# EAGLE design ethero_v1 (EAGLE 6.4)
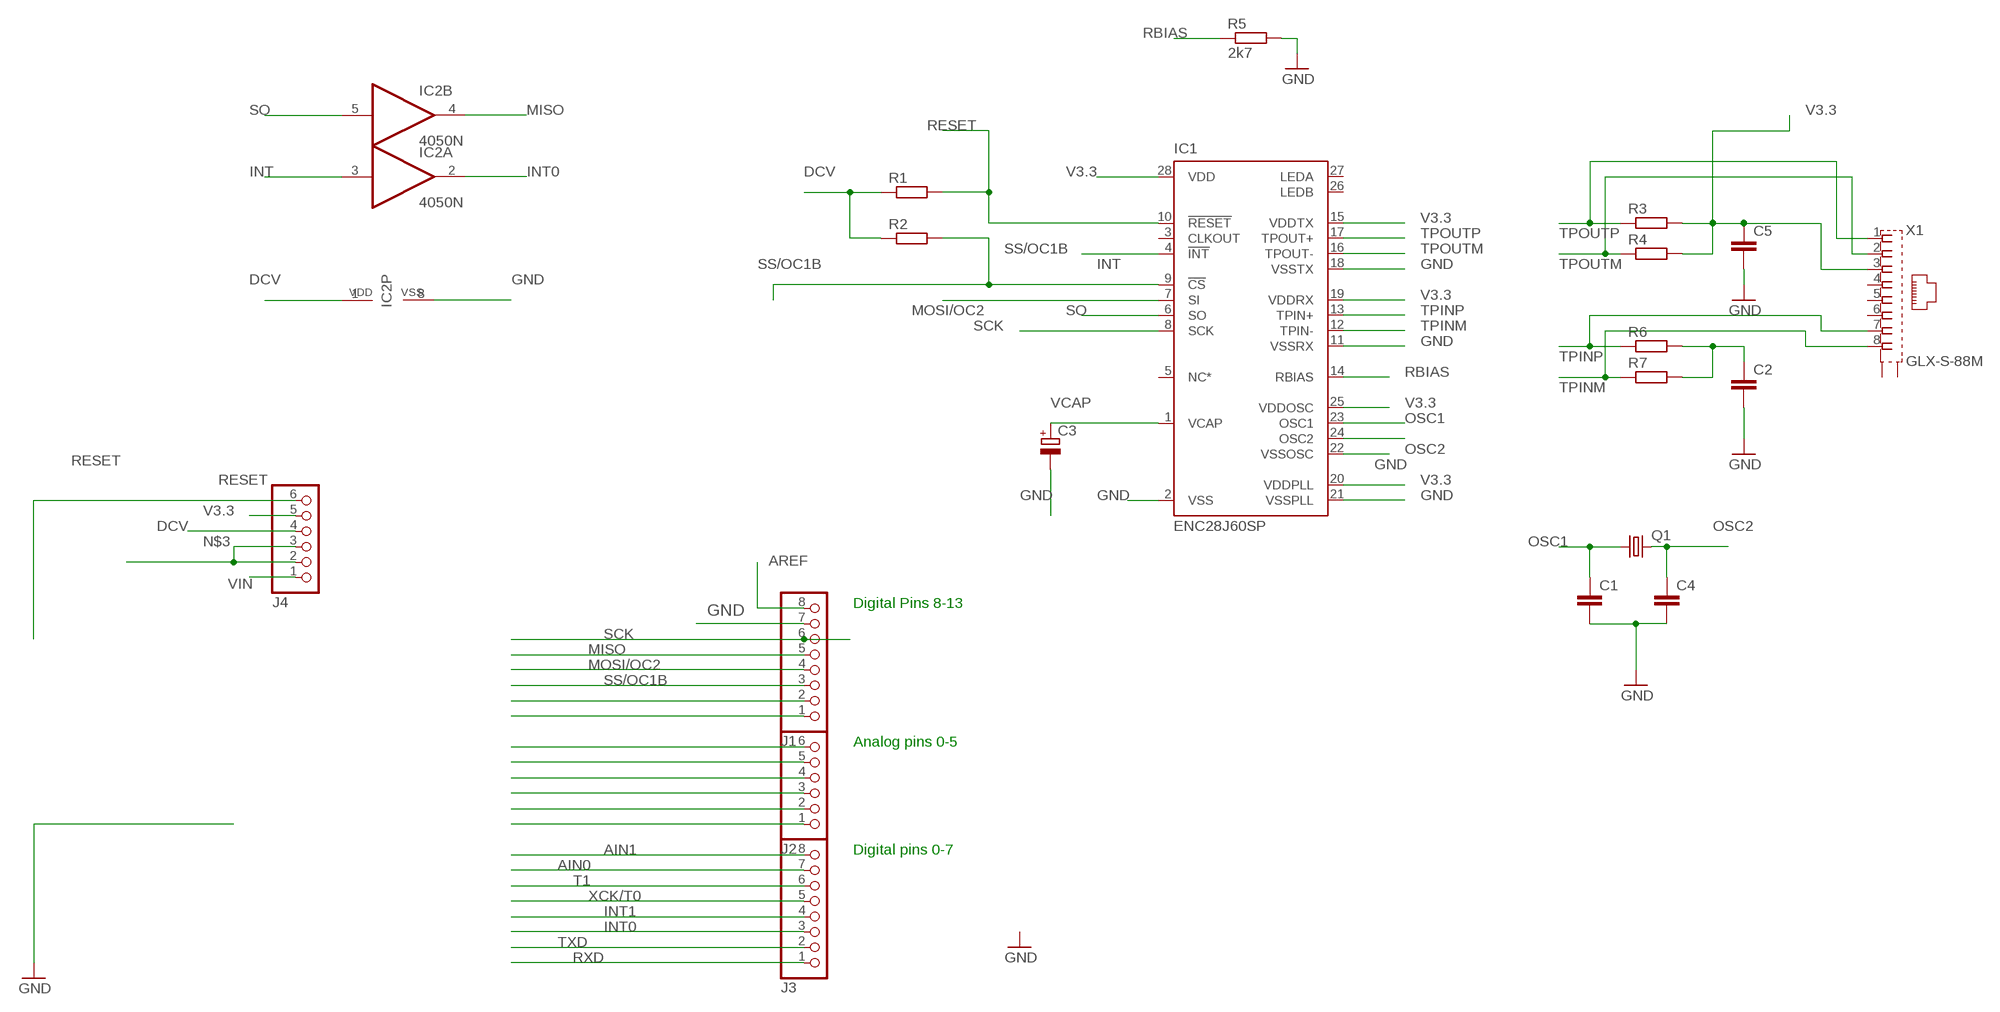
[diagram p0: schematic, sheet 1]

## Parts
C1  C-EU025-025X050  [C025-025X050]
C2  C-EU025-025X050  [C025-025X050]
C3  CPOL-EUE5-5  [E5-5]
C4  C-EU025-025X050  [C025-025X050]
C5  C-EU025-025X050  [C025-025X050]
IC1  ENC28J60SP  [DIL28-3]
IC2  4050N  [DIL16]
J1  PINHD-1X8  [1X08]
J2  PINHD-1X6  [1X06]
J3  PINHD-1X8  [1X08]
J4  PINHD-1X6  [1X06]
Q1  CRYSTALHC18U-V  [HC18U-V]
R1  R-EU_0204/7  [0204/7]
R2  R-EU_0204/7  [0204/7]
R3  R-EU_0204/7  [0204/7]
R4  R-EU_0204/7  [0204/7]
R5  2k7  R-EU_0204/7  [0204/7]
R6  R-EU_0204/7  [0204/7]
R7  R-EU_0204/7  [0204/7]
X1  GLX-S-88M  [GLX-S-88M]

## Nets
AIN0: J3.7
AIN1: J3.8
AREF: J1.8
DCV [power]: IC2.1(P:VDD) J4.4 R1.1 R2.1
GND [power]: C1.2 C2.2 C3.- C4.2 C5.2 IC1.2(VSS) IC1.11(VSSRX) IC1.18(VSSTX) IC1.21(VSSPLL) IC1.22(VSSOSC) IC2.8(P:VSS) J1.7 R5.2
INT: IC1.4(!INT) IC2.3(A:I)
INT0: IC2.2(A:O) J3.3
INT1: J3.4
MISO: IC2.4(B:O) J1.5
MOSI/OC2: IC1.7(SI) J1.4
N$2: J1.2
N$3 [power]: J4.2 J4.3
N$5: C2.1 R6.2 R7.2
N$16: J2.1
N$17: J2.2
N$18: J2.3
N$19: J2.4
N$20: J2.5
N$21: J2.6
N$28: J1.1
OSC1: C1.1 IC1.23(OSC1) Q1.1
OSC2: C4.1 IC1.24(OSC2) Q1.2
RBIAS: IC1.14(RBIAS) R5.1
RESET: IC1.10(!RESET) J4.6 R1.2
RXD: J3.1
SCK: IC1.8(SCK) J1.6
SO: IC1.6(SO) IC2.5(B:I)
SS/OC1B: IC1.9(!CS) J1.3 R2.2
T1: J3.6
TPINM: IC1.12(TPIN-) R7.1 X1.8
TPINP: IC1.13(TPIN+) R6.1 X1.7
TPOUTM: IC1.16(TPOUT-) R4.1 X1.2
TPOUTP: IC1.17(TPOUT+) R3.1 X1.1
TXD: J3.2
V3.3: C5.1 IC1.15(VDDTX) IC1.19(VDDRX) IC1.20(VDDPLL) IC1.25(VDDOSC) IC1.28(VDD) J4.5 R3.2 R4.2 X1.3
VCAP: C3.+ IC1.1(VCAP)
VIN [power]: J4.1
XCK/T0: J3.5
Unconnected: IC1.3(CLKOUT) IC1.5(NC*) IC1.26(LEDB) IC1.27(LEDA) IC2.6(C:O) IC2.7(C:I) IC2.9(D:I) IC2.10(D:O) IC2.11(E:I) IC2.12(E:O) IC2.14(F:I) IC2.15(F:O) X1.4 X1.5 X1.6 X1.S1 X1.S2

## Notes on the sheet
- Digital Pins 8-13
- Analog pins 0-5
- Digital pins 0-7

## Library data of the parts
C1 C2 C4 C5 = resistor:C-EU: CAPACITOR, European symbol
C3 = rcl:CPOL-EU: POLARIZED CAPACITOR, European symbol
IC1 = microchip:ENC28J60: Stand-Alone Ethernet Controller with SPI Interface Source: http://ww1.microchip.com/downloads/en/DeviceDoc/39662c.pdf; MF: MICROCHIP; MPN: ENC28J60/SP; OC_FARNELL: 1084619; OC_NEWARK: 96K3661
IC2 = 40xx:4050: Hex non-inverting BUFFER
J1 J3 = pinhead:PINHD-1X8: PIN HEADER
J2 J4 = pinhead:PINHD-1X6: PIN HEADER
Q1 = crystal:CRYSTAL: CRYSTAL; OC_FARNELL: unknown; OC_NEWARK: unknown
R1-R7 = resistor:R-EU_: RESISTOR, European symbol
X1 = con-kycon:GLX-S-88M: Mod. Jack, Right Angle, 8 posiotion, 8 contatcs RJ45 Source: GLX-S-88M.pdf; OC_FARNELL: unknown; OC_NEWARK: unknown

## Net classes
0 default: width 0.203 mm, clearance 0.203 mm
1 power: width 0.6 mm, clearance 0.305 mm
2 finepitch: width 0.203 mm, clearance 0.203 mm

## Board
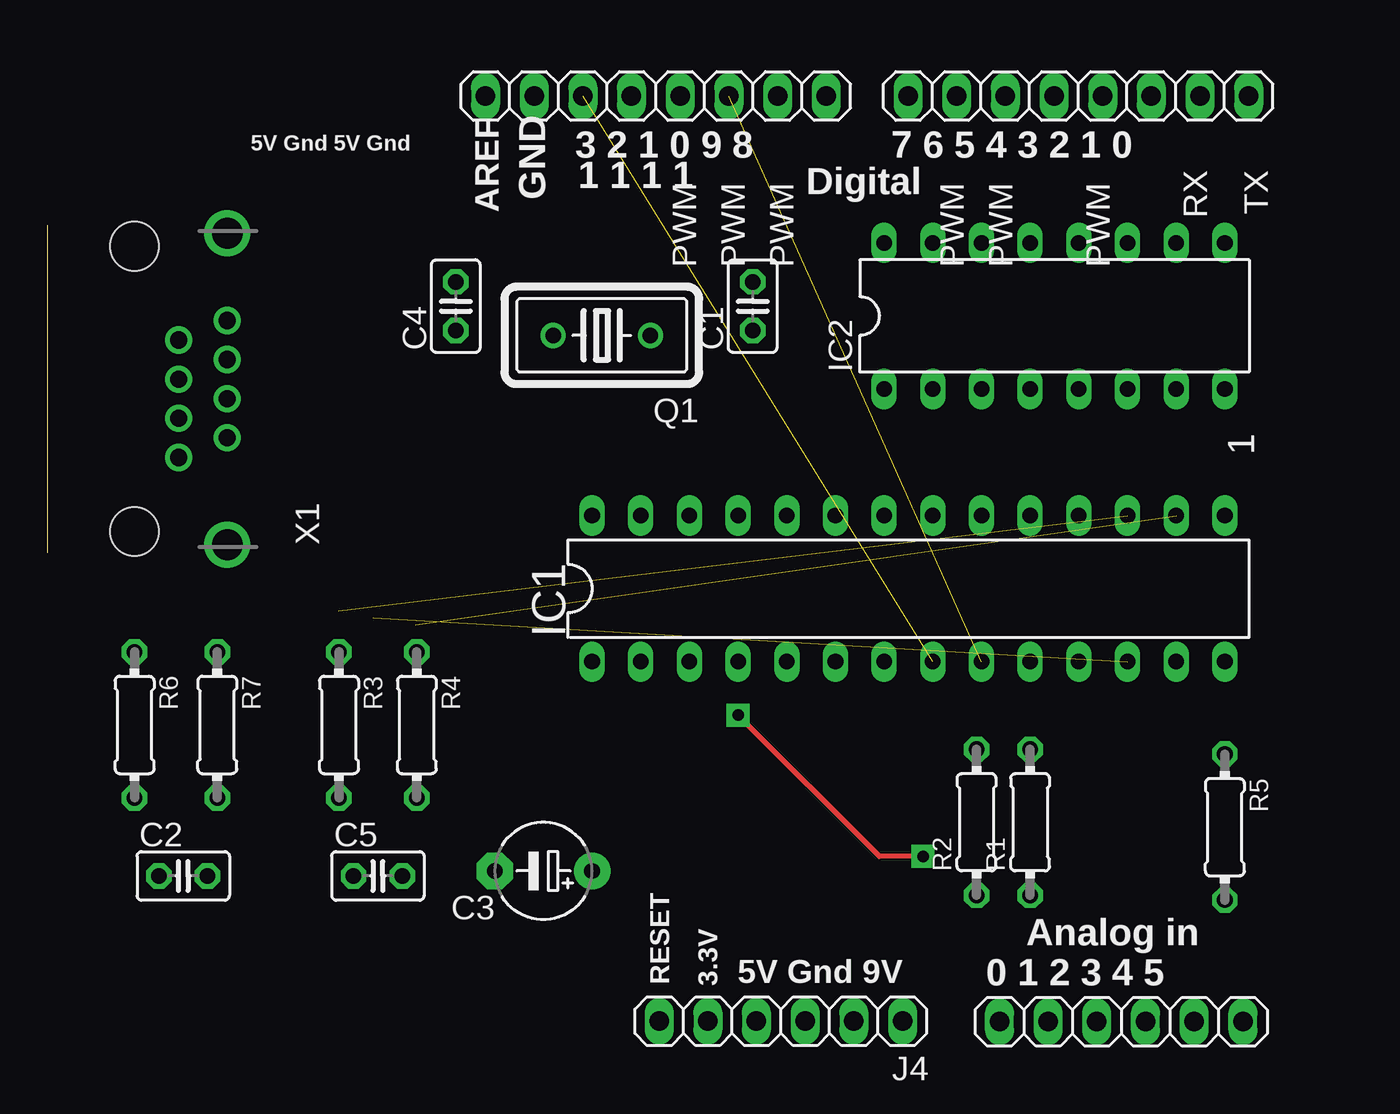
[diagram p1: board, top side]
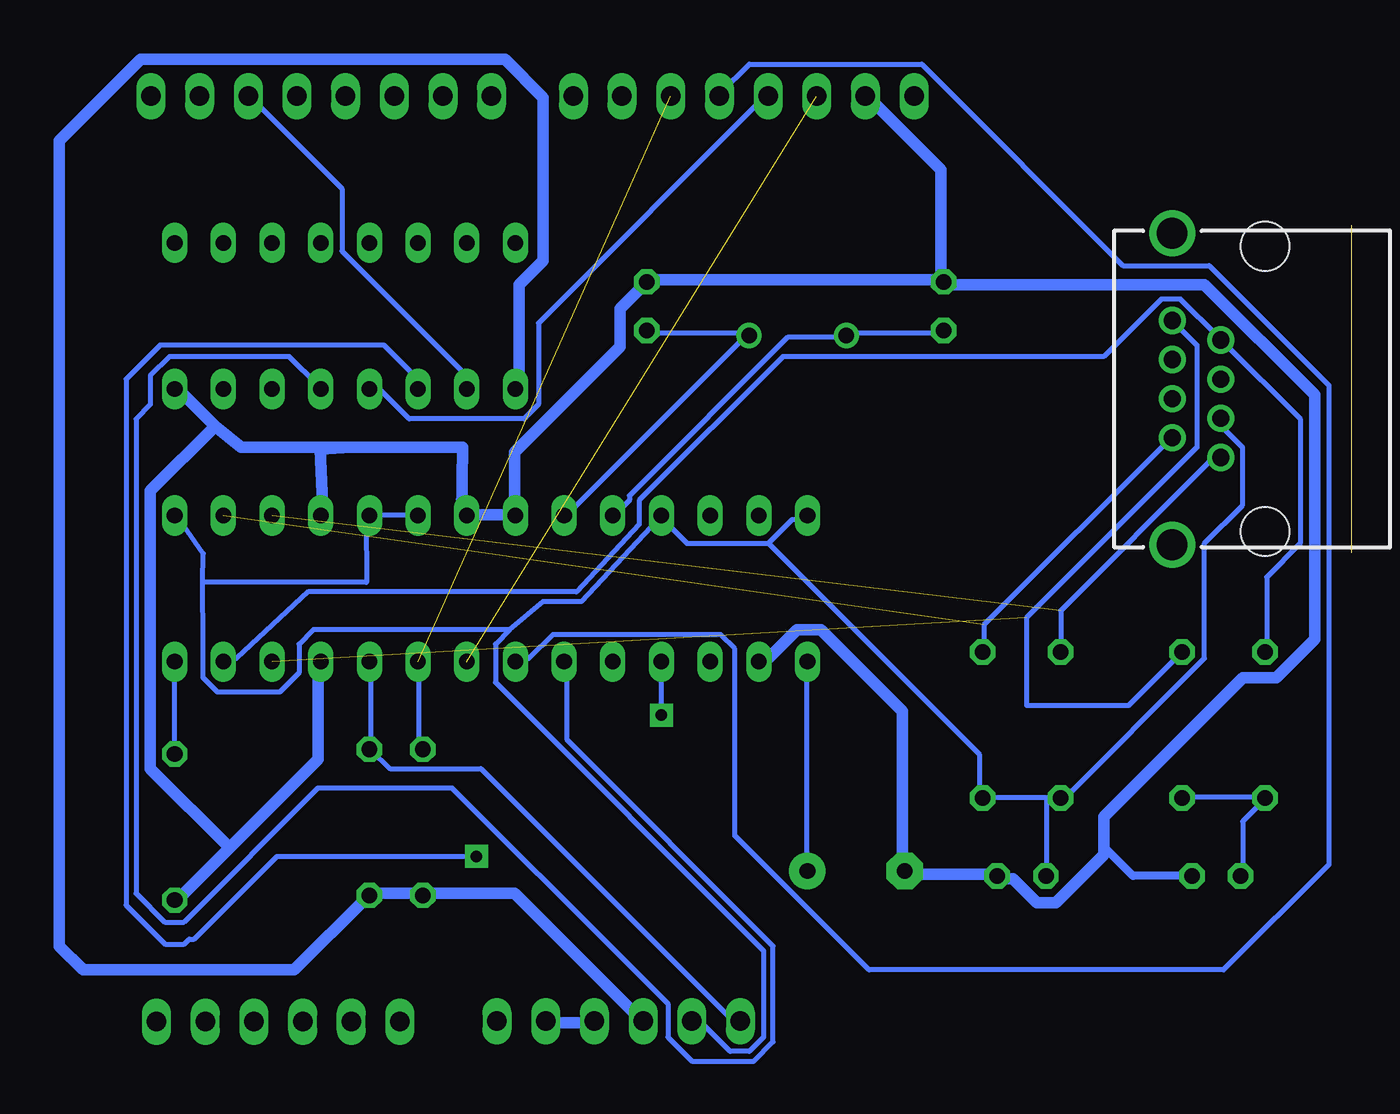
[diagram p2: board, bottom side, seen from below]

Size 0 x 17.06 mm. Coordinates in mm from the lower left corner, seen from the top.
Copper layers (1*16): Top 0.035mm / dielectric 1.5mm / Bottom 0.035mm
Design rules "default": minimum track width 10mil, minimum drill 0.6mm, track to track 8mil, track to pad 8mil, pad to pad 8mil, via to via 12mil, smd to smd 8mil, copper to edge 10mil, drill to drill 15mil, minimum pad ring 10mil, minimum via ring 12mil, stop-mask expansion 4mil, vias tented up to drill 0mil, thermal gap 10mil
tRestrict: area 12.4,21.9 to 16.1,25.6; area 63.1,6.5 to 66.9,10.3; area 63.1,-21.3 to 66.9,-17.5; 10 lines
bRestrict: area 12.4,21.9 to 16.1,25.6; area 63.1,6.5 to 66.9,10.3; area 63.1,-21.3 to 66.9,-17.5; 8 lines

### Footprints (pad centres in the part's own frame; a part is rotated, then mirrored left to right if it is on the bottom)
C025-025X050 = drill 0.813 octagon: 1 -1.27,0; 2 1.27,0
E5-5 = drill 0.813 pad 1.905: + -2.54,0 | drill 0.813 pad 1.905 octagon: - 2.54,0
DIL28-3 = drill 0.813 long: 1 -16.51,-3.81; 2 -13.97,-3.81; 3 -11.43,-3.81; 4 -8.89,-3.81; 5 -6.35,-3.81; 6 -3.81,-3.81; 7 -1.27,-3.81; 8 1.27,-3.81; 9 3.81,-3.81; 10 6.35,-3.81; 11 8.89,-3.81; 12 11.43,-3.81; 13 13.97,-3.81; 14 16.51,-3.81; 15 16.51,3.81; 16 13.97,3.81; 17 11.43,3.81; 18 8.89,3.81; 19 6.35,3.81; 20 3.81,3.81; 21 1.27,3.81; 22 -1.27,3.81; 23 -3.81,3.81; 24 -6.35,3.81; 25 -8.89,3.81; 26 -11.43,3.81; 27 -13.97,3.81; 28 -16.51,3.81
DIL16 = drill 0.813 long: 1 -8.89,-3.81; 2 -6.35,-3.81; 3 -3.81,-3.81; 4 -1.27,-3.81; 5 1.27,-3.81; 6 3.81,-3.81; 7 6.35,-3.81; 8 8.89,-3.81; 9 8.89,3.81; 10 6.35,3.81; 11 3.81,3.81; 12 1.27,3.81; 13 -1.27,3.81; 14 -3.81,3.81; 15 -6.35,3.81; 16 -8.89,3.81
1X08 = drill 1.016 long: 1 -8.89,0; 2 -6.35,0; 3 -3.81,0; 4 -1.27,0; 5 1.27,0; 6 3.81,0; 7 6.35,0; 8 8.89,0
1X06 = drill 1.016 long: 1 -6.35,0; 2 -3.81,0; 3 -1.27,0; 4 1.27,0; 5 3.81,0; 6 6.35,0
HC18U-V = drill 0.813: 1 -2.54,0; 2 2.54,0
0204/7 = drill 0.813 octagon: 1 -3.81,0; 2 3.81,0
GLX-S-88M = drill 0.9 pad 1.422: 1 -3.57,-2.3; 2 -2.55,-4.84; 3 -1.53,-2.3; 4 -0.51,-4.84; 5 0.51,-2.3; 6 1.53,-4.84; 7 2.55,-2.3; 8 3.57,-4.84 | drill 1.6 pad 2.184: S1 -8.125,-4.84; S2 8.125,-4.84 | hole 2.55: -7.44,0; 7.44,0

### Placement (x,y rotation side)
C1  36.78,12.85 90 top  (outside the outline)
C2  7.06,-16.87 0 top  (outside the outline)
C3  25.86,-16.61 180 top  (outside the outline)
C4  21.28,12.85 90 top  (outside the outline)
C5  17.22,-16.87 0 top  (outside the outline)
IC1  44.91,-1.88 0 top  (outside the outline)
IC2  52.53,12.34 0 top  (outside the outline)
J1  31.72,23.81 180 top  (outside the outline)
J2  56.01,-24.48 0 top  (outside the outline)
J3  53.77,23.81 180 top  (outside the outline)
J4  38.25,-24.45 180 top  (outside the outline)
Q1  28.9,11.33 180 top  (outside the outline)
R1  51.26,-14.07 90 top  (outside the outline)
R2  48.46,-14.07 90 top  (outside the outline)
R3  15.19,-8.99 270 top  (outside the outline)
R4  19.25,-8.99 270 top  (outside the outline)
R5  61.42,-14.33 270 top  (outside the outline)
R6  4.52,-8.99 270 top  (outside the outline)
R7  8.84,-8.99 270 top  (outside the outline)
X1  4.52,8.53 90 top  (outside the outline)

### Tracks (layer width: path | path; a pad name or v marks a point on that pad's centre or on a via)
DCV
  Bottom 0.6: IC2.1 43.43,8.72 43.43,13.97 42.18,15.22 42.18,23.72 44.18,25.72 63.18,25.72 67.43,21.47 67.43,-20.53 66.18,-21.78 55.18,-21.78 51.43,-18.03 R1.1 51.18,-17.78 48.68,-17.78 R2.1 48.18,-17.78 43.68,-17.78 37.18,-24.28 J4.4
GND
  Bottom 0.406: C2.2 11.41,-16.87 12.93,-15.34
  Bottom 0.6: 58.56,-15.4 61.18,-18.03 R5.2 | 58.56,-15.4 53.93,-10.78 53.93,-5.78 IC1.11 | 52.19,5.5 53.84,5.37 | 53.84,5.37 53.68,1.97 IC1.18 | 52.18,5.5 46.4,5.5 46.43,1.97 IC1.21 45.93,1.97 43.68,1.97 IC1.22 43.68,2.22 43.68,5.22 38.18,10.72 38.18,12.72 36.93,13.97 C1.2 36.68,14.22 21.68,14.22 C4.2 | 52.18,5.5 52.19,5.5 | 59.31,6.6 57.96,5.5 52.19,5.5 | 59.31,6.6 61.18,8.47 IC2.8 | 52.18,5.5 53.84,5.37 | 58.56,-15.4 62.68,-11.28 62.68,3.22 59.31,6.6 | IC1.2 30.93,-5.53 30.43,-5.53 28.93,-4.03 27.68,-4.03 23.43,-8.28 23.43,-16.53 C3.- 23.18,-16.78 18.68,-16.78 C5.2 18.43,-17.03 17.68,-17.03 16.43,-18.28 15.43,-18.28 12.93,-15.78 12.93,-15.34 12.93,-13.78 5.68,-6.53 3.93,-6.53 1.93,-4.53 1.93,8.22 7.68,13.97 21.18,13.97 C4.2 | C4.2 21.43,14.22 21.43,19.97 25.18,23.72 J1.7
INT  (via drill 0.6)
  Top 0.254: v45.67,-15.85 43.38,-15.85 v36.02,-8.49
  Bottom 0.254: IC2.3 48.72,9.04 50.49,10.82 62.18,10.82 63.96,9.04 63.96,-18.39 61.92,-20.42 60.91,-20.42 60.65,-20.17 60.4,-20.17 56.08,-15.85 v45.67,-15.85 | v36.02,-8.49 IC1.4
INT0
  Bottom 0.254: IC2.2 46.18,8.72 46.18,9.22 52.68,15.72 52.68,18.97 57.43,23.72 J3.3
MISO
  Bottom 0.254: IC2.4 51.18,8.47 50.68,8.47 49.18,6.97 43.18,6.97 42.43,7.72 42.43,11.97 30.68,23.72 J1.5
MOSI/OC2
  Bottom 0.254: IC1.7 43.43,-5.53 42.93,-5.53 41.68,-4.28 32.93,-4.28 32.18,-5.03 32.18,-14.78 25.18,-21.78 6.68,-21.78 1.18,-16.28 1.18,8.72 7.43,14.97 11.93,14.97 22.43,25.47 31.43,25.47 32.93,23.97 J1.4
N$1  (via drill 0.6)
  other vias: 45.67,-15.85
N$3
  Bottom 0.6: J4.3 39.68,-24.53 41.93,-24.53 J4.2
N$5
  Bottom 0.254: C2.1 5.68,-16.78 5.68,-14.03 4.68,-13.03 R6.2 4.68,-12.78 8.68,-12.78 R7.2
N$6  (via drill 0.6)
  other vias: 36.02,-8.49
OSC1
  Bottom 0.254: C1.1 36.68,11.47 31.68,11.47 Q1.1 31.68,11.22 40.93,1.97 IC1.23
OSC2
  Bottom 0.254: C4.1 21.43,11.47 26.18,11.47 Q1.2 26.43,11.22 29.43,11.22 37.68,2.97 37.68,2.72 38.43,1.97 IC1.24
RBIAS
  Bottom 0.254: R5.1 61.43,-10.28 61.43,-5.78 IC1.14
RESET
  Bottom 0.254: IC1.10 51.18,-5.78 51.18,-10.03 R1.2 51.18,-10.28 50.18,-11.28 45.43,-11.28 32.43,-24.28 31.93,-24.28 J4.6
SCK  (1 unrouted)
SO
  Bottom 0.254: IC1.6 40.93,-5.78 40.93,-9.78 30.18,-20.53 30.18,-25.53 31.18,-26.53 34.43,-26.53 35.68,-25.28 35.68,-23.53 42.43,-16.78 42.46,-16.78 46.94,-12.3 53.95,-12.3 60.93,-19.28 61.93,-19.28 63.43,-17.78 63.43,6.97 62.68,7.72 62.68,9.22 61.68,10.22 55.43,10.22 53.93,8.72 IC2.5
SS/OC1B  (1 unrouted)
  Bottom 0.254: R2.2 48.68,-10.03 48.68,-5.78 IC1.9
TPINM  (1 unrouted)
  Bottom 0.254: 8.93,-5.28 R7.1 11.63,-7.98 16.97,-7.98 16.97,-3.41 8.08,5.48 8.08,10.82 9.23,11.97 9.43,11.97 X1.8
TPINP
  Bottom 0.254: R6.1 4.43,-5.03 4.43,-1.28 2.68,0.47 2.68,6.97 6.68,10.97 X1.7 6.93,11.22 8.93,13.22 9.93,13.22 12.93,10.22 29.68,10.22 37.18,2.72 37.18,1.47 40.46,-2.06 54.46,-2.06 58.18,-5.53 58.68,-5.53 IC1.13
TPOUTM  (1 unrouted)
  Bottom 0.254: R4.1 19.18,-5.03 19.18,-3.78 9.43,5.97 X1.2
TPOUTP  (1 unrouted)
  Bottom 0.254: R3.1 15.18,-5.03 15.18,-3.03 7.43,4.72 6.93,4.72 X1.1
V3.3
  Bottom 0.254: 15.93,-12.78 19.18,-12.78 R4.2 19.43,-12.78 19.43,-10.53 30.43,0.47 | 15.93,-12.78 15.43,-12.78 R3.2 15.18,-13.03 7.68,-5.53 7.68,0.47 5.68,2.47 5.68,5.47 6.68,6.47 6.68,6.97 X1.3 | 15.93,-12.78 15.93,-16.78 C5.1 | IC1.20 48.93,1.97 51.18,1.97 IC1.19 51.43,1.72 51.41,-1.56 59.94,-1.56 | 59.94,-1.56 59.92,-0.06 61.18,1.72 IC1.15 | 30.43,0.47 29.18,1.72 28.43,1.72 IC1.28 | 30.43,0.47 34.68,0.47 35.93,1.72 IC1.25 36.18,1.72 40.21,-2.56 42.21,-2.56 43.93,-4.03 | 43.93,-4.03 44.68,-4.78 44.68,-6.78 30.68,-20.78 30.68,-25.28 31.43,-26.03 32.43,-26.03 33.93,-24.53 34.43,-24.53 J4.5 | 59.94,-1.56 59.94,-1.49 59.93,-4.78 59.93,-6.53 59.18,-7.28 55.93,-7.28 54.93,-6.28 54.93,-4.78 54.18,-4.03 43.93,-4.03
VCAP
  Bottom 0.254: IC1.1 28.43,-5.78 28.43,-16.53 C3.+

### Text on the board
tPlace: RESET | 3.3V
tNames: 5V Gnd 5V Gnd | 3 2 1 0 9 8 | 7 6 5 4 3 2 1 0 | RX | TX | 1 1 1 1 | Digital | AREF | GND | PWM | PWM | PWM | PWM | PWM | PWM | 1 | Analog in | 5V Gnd 9V | 0 1 2 3 4 5
Edit History: 20070917 WestfW: Move (CC) symbol, use silk_gen to get 5mil widths | 20070917 WestfW: Manual route some, autoroute rest. Fiddle. | 20070917 WestfW: Now V1.16. Change components to TH. | 20070911 WestfW: Now V1.15. Move tracks slightly for shielding | 20070900 Daniel: Schematic and initial placement
_tsilk: C12 | C8 | 3 2 1 0 9 8 | 7 6 5 4 3 2 1 0 | RX | TX | 1 1 1 1 | Digital | X2 | AREF | GND | R7 | PWM | PWM | PWM | PWM | PWM | PWM | PWR | IC1 | 13 | Freeduino | FT232RL | c | c | R10 | V1.16 | TX | R8 | RX | 16Mhz | 1 | R1 | R9 | C3 | C10 | R12 | ]USB | R11 | ]EXT | F1 | Q1 | C2 | ICSP | RESET | 1 | CRS | M. Banzi | D. Cuartielles | D. Mellis | N. Zambetti | C5 | C4 | ATMEGA168 | IC2 | D1 | C1 | 47u | C7 | 47u | C6 | C9 | Analog in | 5V Gnd 9V | RESET | 3.3V | 0 1 2 3 4 5 | 9V in